# EAGLE design Stick SD Serayu 2024 (EAGLE 9.6.2)
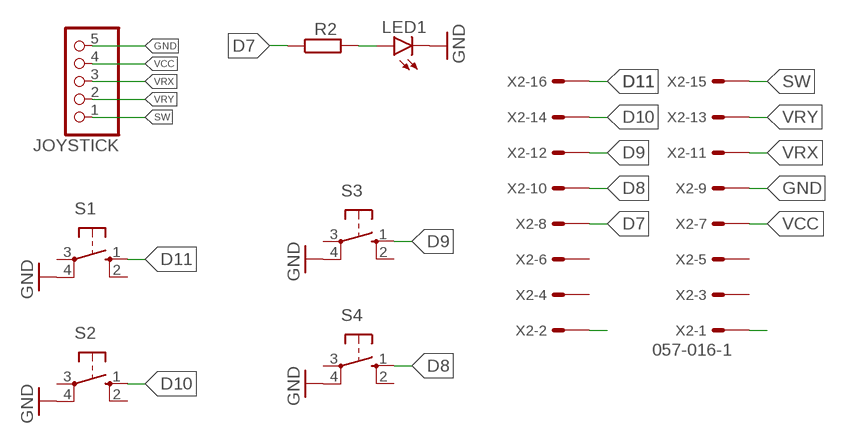
[diagram p0: schematic, sheet 1]

## Parts
JOYSTICK  PINHD-1X5  [1X05]
LED1  LED5MM  [LED5MM]
R2  R-EU_R1206  [R1206]
S1  40-XX  [B3F-40XX]
S2  40-XX  [B3F-40XX]
S3  40-XX  [B3F-40XX]
S4  40-XX  [B3F-40XX]
X2  057-016-1  [057-016-1]

## Nets
D7: R2.1 X2.8
D8: S4.1(S) X2.10
D9: S3.1(S) X2.12
D10: S2.1(S) X2.14
D11: S1.1(S) X2.16
GND: JOYSTICK.5 LED1.K(C) S1.4(P1) S2.4(P1) S3.4(P1) S4.4(P1) X2.9
N$1: LED1.A R2.2
N$9: X2.2
N$10: X2.1
SW: JOYSTICK.1 X2.15
VCC: JOYSTICK.4 X2.7
VRX: JOYSTICK.3 X2.11
VRY: JOYSTICK.2 X2.13
Unconnected: S1.2(S1) S1.3(P) S2.2(S1) S2.3(P) S3.2(S1) S3.3(P) S4.2(S1) S4.3(P) X2.3 X2.4 X2.5 X2.6

## Library data of the parts
JOYSTICK = pinhead:PINHD-1X5: PIN HEADER
LED1 = led:LED: LED OSRAM: - CHIPLED LG R971, LG N971, LY N971, LG Q971, LY Q971, LO R971, LY R971 LH N974, LH R974 LS Q976, LO Q976, LY Q976 LO Q996 - Hyper CHIPLED LW Q18S LB Q993, LB Q99A, LB R99A - SideLED LS A670, LO A670, LY A670, LG A670, LP A670 LB A673, LV A673, LT A673, LW A673 LH A674 LY A675 LS A676, LA A676, LO A676, LY A676, LW A676 LS A679, LY A679, LG A679 - Hyper Micro SIDELED® LS Y876, LA Y876, LO Y876, LY Y876 LT Y87S - SmartLED LW L88C, LW L88S LB L89C, LB L89S, LG L890 LS L89K, LO L89K, LY L89K LS L896, LA L896, LO L896, LY L896 - TOPLED LS T670, LO T670, LY T670, LG T670, LP T670 LSG T670, LSP T670, LSY T670, LOP T670, LYG T670 LG T671, LOG T671, LSG T671 LB T673, LV T673, LT T673, LW T673 LH T674 LS T676, LA T676, LO T676, LY T676, LB T676, LH T676, LSB T676, LW T676 LB T67C, LV T67C, LT T67C, LS T67K, LO T67K, LY T67K, LW E67C LS E67B, LA E67B, LO E67B, LY E67B, LB E67C, LV E67C, LT E67C LW T67C LS T679, LY T679, LG T679 LS T770, LO T770, LY T770, LG T770, LP T770 LB T773, LV T773, LT T773, LW T773 LH T774 LS E675, LA E675, LY E675, LS T675 LS T776, LA T776, LO T776, LY T776, LB T776 LHGB T686 LT T68C, LB T68C - Hyper Mini TOPLED® LB M676 - Mini TOPLED Santana® LG M470 LS M47K, LO M47K, LY M47K Source: http://www.osram.convergy.de LUXEON: - LUMILED® LXK2-PW12-R00, LXK2-PW12-S00, LXK2-PW14-U00, LXK2-PW14-V00 LXK2-PM12-R00, LXK2-PM12-S00, LXK2-PM14-U00 LXK2-PE12-Q00, LXK2-PE12-R00, LXK2-PE12-S00, LXK2-PE14-T00, LXK2-PE14-U00 LXK2-PB12-K00, LXK2-PB12-L00, LXK2-PB12-M00, LXK2-PB14-N00, LXK2-PB14-P00, LXK2-PB14-Q00 LXK2-PR12-L00, LXK2-PR12-M00, LXK2-PR14-Q00, LXK2-PR14-R00 LXK2-PD12-Q00, LXK2-PD12-R00, LXK2-PD12-S00 LXK2-PH12-R00, LXK2-PH12-S00 LXK2-PL12-P00, LXK2-PL12-Q00, LXK2-PL12-R00 Source: www.luxeon.com KINGBRIGHT: KA-3528ASYC Source: www.kingbright.com
R2 = rcl:R-EU_: RESISTOR, European symbol; SPICEPREFIX: R
S1-S4 = switch-omron:40-XX: OMRON SWITCH; MF: OMRON COMPONENTS USA; MPN: B3F-4000; OC_FARNELL: 176434; OC_NEWARK: 36K3105
X2 = con-panduit:057-016-: CONNECTOR 10-pin series 057 contact pc board low profile headers; OC_FARNELL: unknown; OC_NEWARK: unknown

## Board
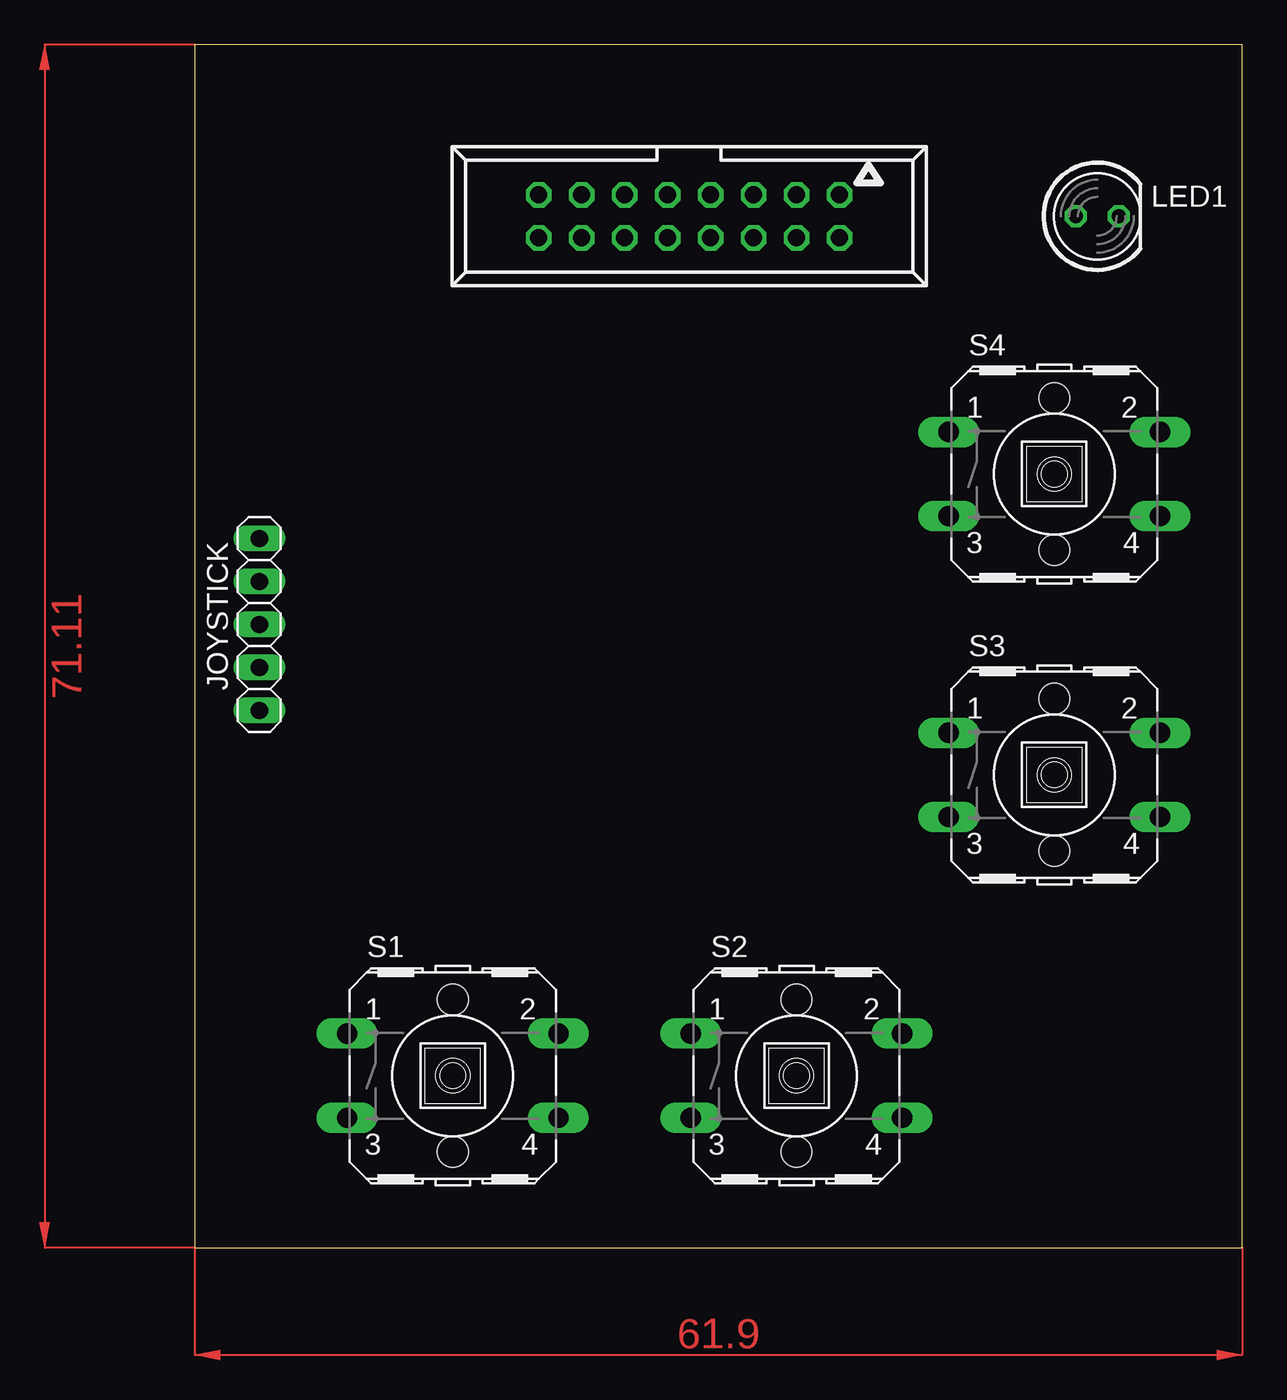
[diagram p1: board, top side]
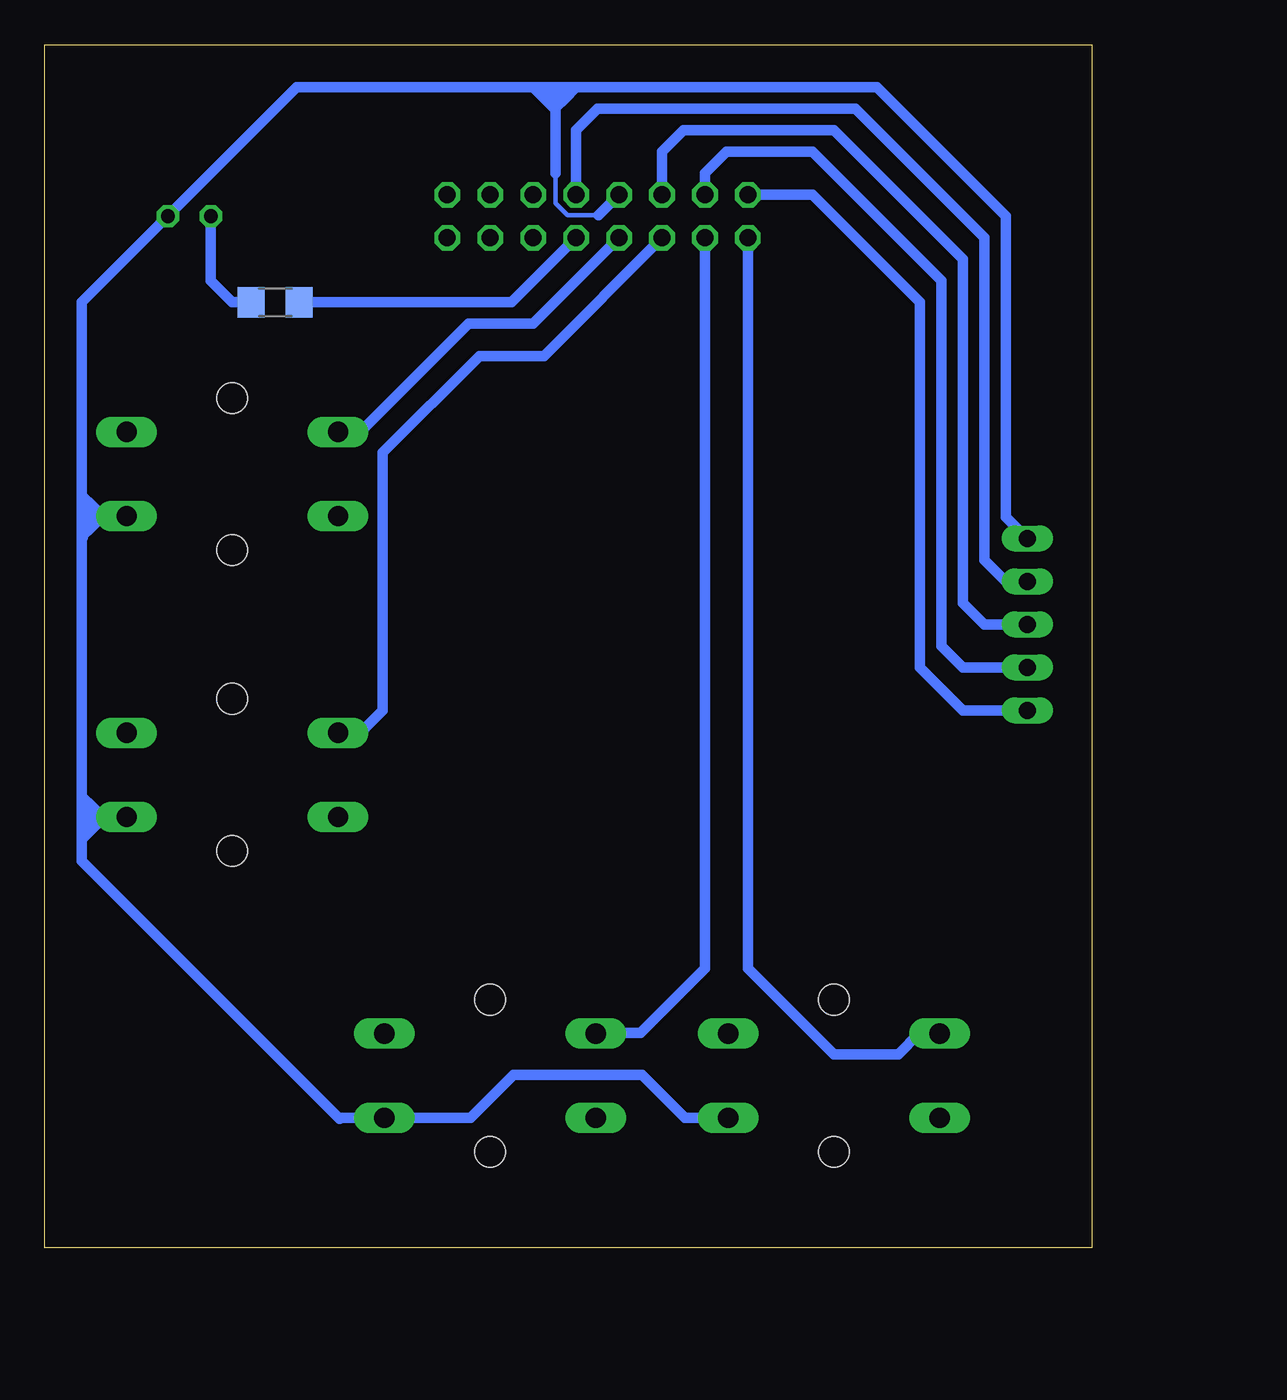
[diagram p2: board, bottom side, seen from below]

Size 61.9 x 71.11 mm. Coordinates in mm from the lower left corner, seen from the top.
Outline: 0,0 61.9,0 61.9,71.11 0,71.11 0,0
Copper layers (1*16): Top 0.035mm / dielectric 1.5mm / Bottom 0.035mm
Design rules "default": minimum track width 6mil, minimum drill 0.35mm, track to track 6mil, track to pad 6mil, pad to pad 6mil, via to via 6mil, smd to smd 6mil, copper to edge 40mil, drill to drill 6mil, minimum pad ring 10mil, minimum via ring 8mil, stop-mask expansion 4mil, vias tented up to drill 0mil, thermal gap 10mil

### Footprints (pad centres in the part's own frame; a part is rotated, then mirrored left to right if it is on the bottom)
1X05 = drill 1.016 long: 1 -5.08,0; 2 -2.54,0; 3 0,0; 4 2.54,0; 5 5.08,0
LED5MM = drill 0.813 octagon: A -1.27,0; K 1.27,0
R1206 = smd 1.6 x 1.803: 1 -1.422,0; 2 1.422,0
B3F-40XX = drill 1.194 long: 1 -6.248,2.489; 2 6.248,2.489; 3 -6.248,-2.489; 4 6.248,-2.489 | hole 1.803: 0,-4.496; 0,4.496
057-016-1 = drill 1 octagon: 1 -8.89,-1.27; 2 -8.89,1.27; 3 -6.35,-1.27; 4 -6.35,1.27; 5 -3.81,-1.27; 6 -3.81,1.27; 7 -1.27,-1.27; 8 -1.27,1.27; 9 1.27,-1.27; 10 1.27,1.27; 11 3.81,-1.27; 12 3.81,1.27; 13 6.35,-1.27; 14 6.35,1.27; 15 8.89,-1.27; 16 8.89,1.27

### Placement (x,y rotation side)
JOYSTICK  3.81,36.83 90 top
LED1  53.34,60.96 0 top
R2  48.26,55.88 180 bottom
S1  15.24,10.16 0 top
S2  35.56,10.16 0 top
S3  50.8,27.94 0 top
S4  50.8,45.72 0 top
X2  29.21,60.96 180 top

### Tracks (layer width: path | path; a pad name or v marks a point on that pad's centre or on a via)
D7
  Bottom 0.61: X2.8 34.29,55.88 R2.1
D8
  Bottom 0.61: X2.10 33.02,54.61 36.83,54.61 43.23,48.21 S4.1
D9
  Bottom 0.61: S3.1 43.23,30.43 41.91,31.75 41.91,46.99 36.2,52.7 32.38,52.7 X2.12
D10
  Bottom 0.61: S2.1 29.26,12.7 26.67,12.7 22.86,16.51 X2.14
D11
  Bottom 0.61: X2.16 20.32,16.51 15.24,11.43 11.43,11.43 10.21,12.65 S1.1
GND
  Bottom 0.254: 31.69,63.5 31.69,61.73 30.98,61.02 30.48,61.02 | 29.15,61.02 30.48,61.02 | 30.48,61.02
  Bottom 0.406: X2.9 28,62.23
  Bottom 0.61: 59.69,42.01 59.69,26.67 | 59.69,42.01 59.69,43.18 | 59.69,44.45 59.69,55.88 LED1.K 46.99,68.58 33.02,68.58 | 59.69,42.01 59.64,41.96 | JOYSTICK.5 5.08,43.18 5.08,60.96 12.7,68.58 30.48,68.58 | S1.4 24.03,7.67 26.57,10.21 34.19,10.21 36.73,7.67 S2.4 44.4,7.67 44.45,7.62 59.69,22.86 59.69,24.13 | X2.9 29.15,61.02 | S4.4 58.47,43.23 | 58.47,43.23 59.64,43.23 | 59.69,43.18 59.64,43.23 | 58.47,43.23 59.11,42.6 | 59.11,42.6 59.69,42.01 | 59.11,42.6 59.11,42.7 59.64,43.23 | 58.47,43.23 59.05,43.81 | 59.05,43.81 59.69,44.45 | 59.69,44.45 59.69,43.18 | 59.64,43.23 59.05,43.81 | 31.75,68.58 30.48,68.58 | 33.02,68.58 31.75,68.58 | 31.75,68.58 31.69,68.52 | 31.69,68.52 31.69,67.37 | 31.69,67.37 31.69,63.5 | 30.48,68.58 31.12,67.95 | 31.12,67.95 31.69,67.37 | 31.69,67.37 31.81,67.37 | 33.02,68.58 32.38,67.95 | 32.38,67.95 31.81,67.37 | 31.81,67.37 31.75,67.43 31.75,68.58 | 31.75,68.58 32.38,67.95 | 31.12,67.95 31.69,68.52 | 57.15,25.4 57.15,25.35 S3.4 58.47,25.45 | 58.47,25.45 59.64,25.45 | 58.47,25.45 59.05,26.04 | 59.05,26.04 59.69,26.67 | 59.69,26.67 59.69,25.5 | 59.64,24.18 59.05,24.77 | 59.05,24.77 58.47,25.35 58.47,25.45 | 59.69,25.5 59.16,26.04 59.05,26.04 | 59.64,24.18 59.64,25.45 | 59.64,24.18 59.69,24.13 | 59.05,24.77 59.05,24.87 59.64,25.45 | 59.64,25.45 59.69,25.5 | 59.69,24.13 59.69,25.5
N$1
  Bottom 0.61: LED1.A 52.07,57.15 50.8,55.88 R2.2
SW
  Bottom 0.61: X2.15 16.51,62.23 10.16,55.88 10.16,34.29 7.62,31.75 JOYSTICK.1
VCC
  Bottom 0.61: X2.7 30.48,66.04 29.21,67.31 13.97,67.31 6.35,59.69 6.35,40.64 5.08,39.37 JOYSTICK.4
VRX
  Bottom 0.61: X2.11 25.4,64.77 24.13,66.04 15.24,66.04 7.62,58.42 7.62,38.1 6.35,36.83 JOYSTICK.3
VRY
  Bottom 0.61: X2.13 22.86,63.5 21.59,64.77 16.51,64.77 8.89,57.15 8.89,35.56 7.62,34.29 JOYSTICK.2
(copper drawn outside any net)
  shapes: Top area x2